# Altium schematic sheet P07_F28379D-PWR.SchDoc
size 301 x 239 mm
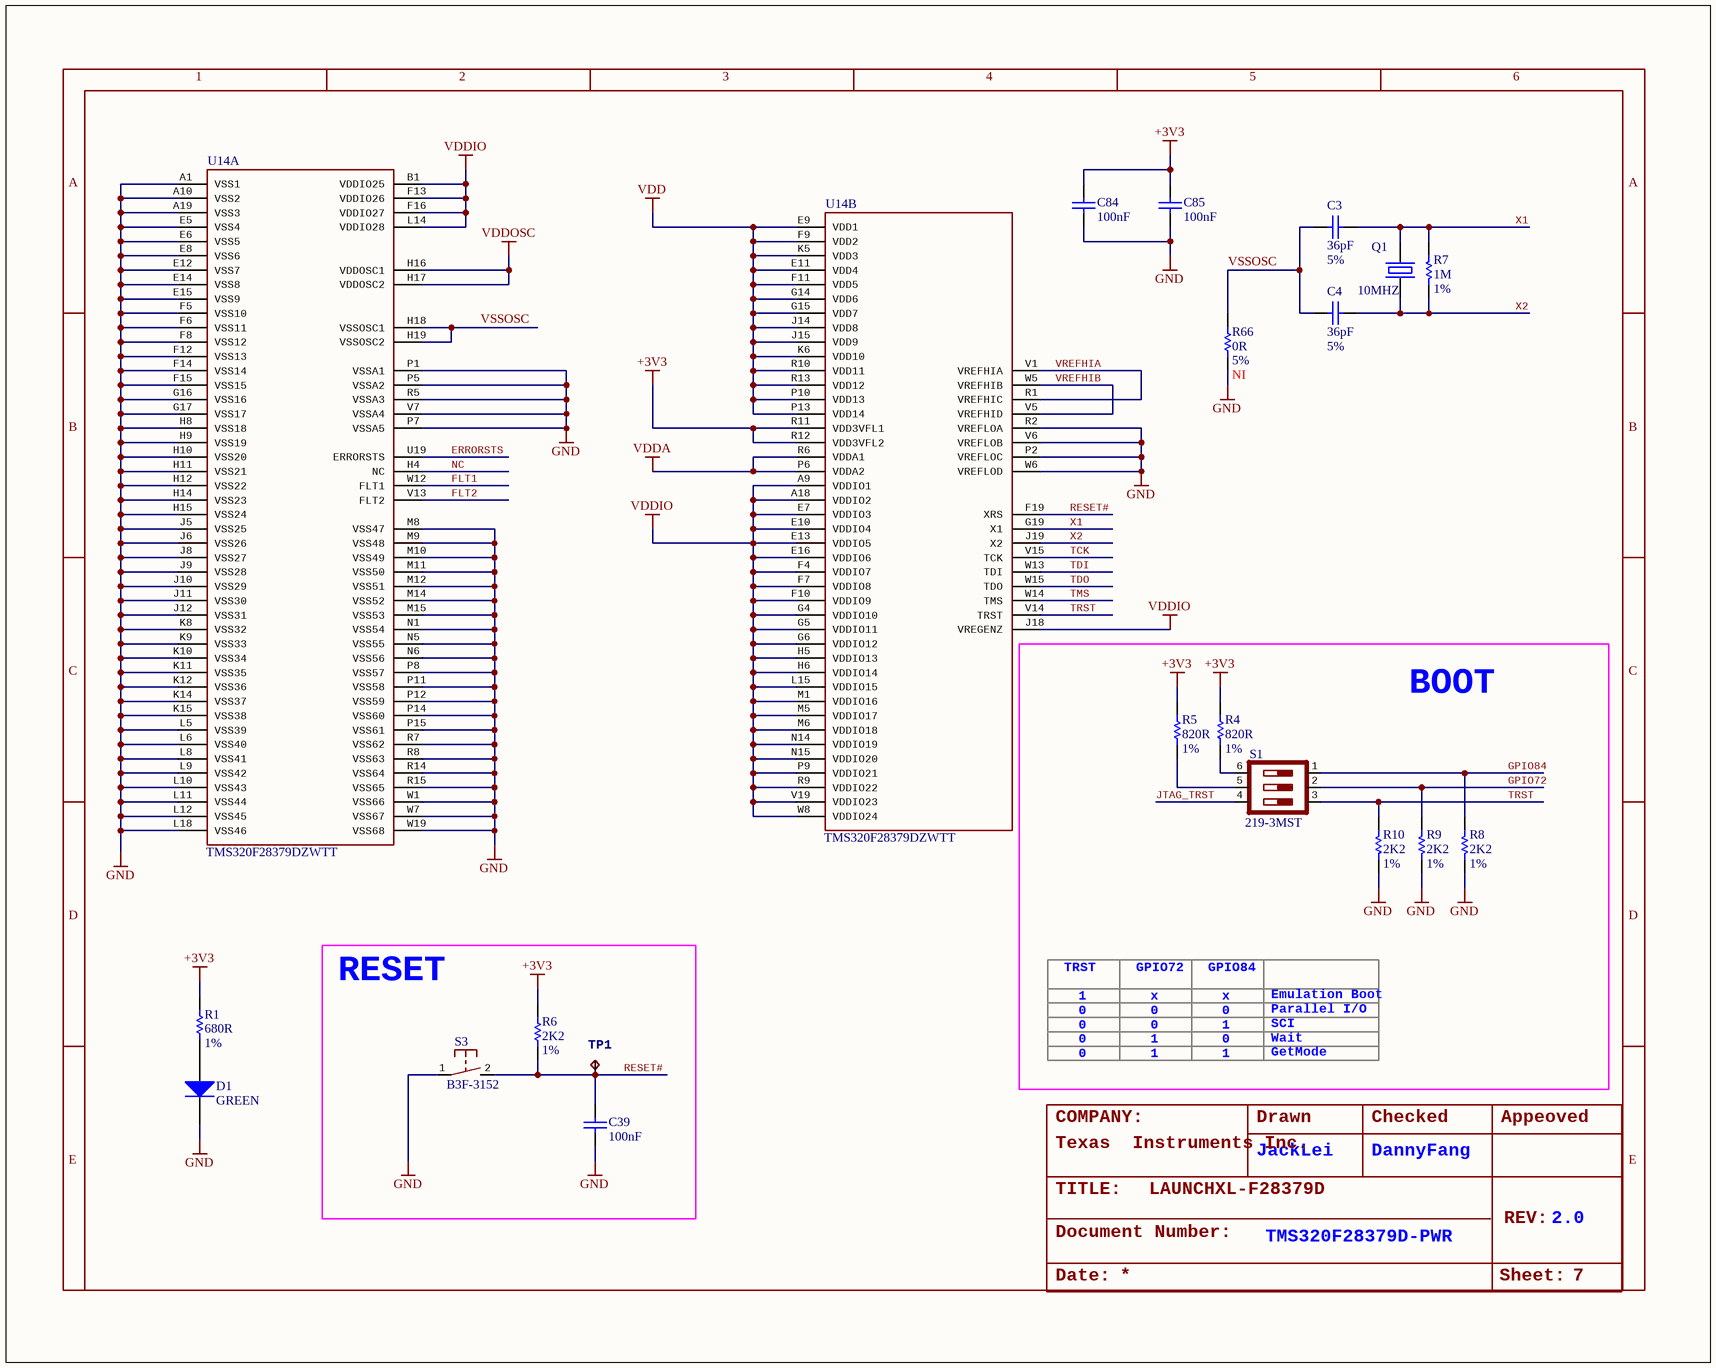
[diagram p0: P07_F28379D-PWR.SchDoc]

## Parts
C3  Rating: 5%  [C0402]  (hidden comment: 36pF)
C4  Rating: 5%  [C0402]  (hidden comment: 36pF)
C39  100nF  [C0402]
C84  100nF  [C0402]
C85  100nF  [C0402]
D1  value GREEN  [D0805]  (hidden comment: 150080VS75000)
Q1  value 10MHZ  [OSC488P1105X465X350-2N]  (hidden comment: ATS100B-E)
R1  Rating: 1%  [R0402]  (hidden comment: 680R)
R4  Rating: 1%  [R0402]  (hidden comment: 820R)
R5  Rating: 1%  [R0402]  (hidden comment: 820R)
R6  Rating: 1%  [R0402]  (hidden comment: 2K2)
R7  Rating: 1%  [R0402]  (hidden comment: 1M)
R8  Rating: 1%  [R0402]  (hidden comment: 2K2)
R9  Rating: 1%  [R0402]  (hidden comment: 2K2)
R10  Rating: 1%  [R0402]  (hidden comment: 2K2)
R66  Rating: 5%  ASSY: NI  [R0402]  (hidden comment: 0R)
S1  219-3MST  [SW254P990X385-6N]
S3  B3F-3152  [SW4P730X625]
TP1  TESTPAD_TPB1,27  [TESTPAD_B1,27]  (value not drawn)
U14  TMS320F28379DZWTT  [BGA337C80P19X19_1600X1600X140]  (parts A,B of 5)

## Blocks framed on the sheet
BOOT: R4 R5 R8-R10 S1
RESET: C39 R6 S3 TP1

## Nets
+3V3: C84.1 C85.1 R1.2 R4.2 R5.2 R6.2 U14.R11(VDD3VFL1) U14.R12(VDD3VFL2)
GND: C39.2 C84.2 C85.2 D1.1 R8.1 R9.1 R10.1 R66.2 S3.1(P) U14.A1(VSS1) U14.A10(VSS2) U14.A19(VSS3) U14.E5(VSS4) U14.E6(VSS5) U14.E8(VSS6) U14.E12(VSS7) U14.E14(VSS8) U14.E15(VSS9) U14.F5(VSS10) U14.F6(VSS11) U14.F8(VSS12) U14.F12(VSS13) U14.F14(VSS14) U14.F15(VSS15) U14.G16(VSS16) U14.G17(VSS17) U14.H8(VSS18) U14.H9(VSS19) U14.H10(VSS20) U14.H11(VSS21) U14.H12(VSS22) U14.H14(VSS23) U14.H15(VSS24) U14.J5(VSS25) U14.J6(VSS26) U14.J8(VSS27) U14.J9(VSS28) U14.J10(VSS29) U14.J11(VSS30) U14.J12(VSS31) U14.K8(VSS32) U14.K9(VSS33) U14.K10(VSS34) U14.K11(VSS35) U14.K12(VSS36) U14.K14(VSS37) U14.K15(VSS38) U14.L5(VSS39) U14.L6(VSS40) U14.L8(VSS41) U14.L9(VSS42) U14.L10(VSS43) U14.L11(VSS44) U14.L12(VSS45) U14.L18(VSS46) U14.M8(VSS47) U14.M9(VSS48) U14.M10(VSS49) U14.M11(VSS50) U14.M12(VSS51) U14.M14(VSS52) U14.M15(VSS53) U14.N1(VSS54) U14.N5(VSS55) U14.N6(VSS56) U14.P1(VSSA1) U14.P2(VREFLOC) U14.P5(VSSA2) U14.P7(VSSA5) U14.P8(VSS57) U14.P11(VSS58) U14.P12(VSS59) U14.P14(VSS60) U14.P15(VSS61) U14.R2(VREFLOA) U14.R5(VSSA3) U14.R7(VSS62) U14.R8(VSS63) U14.R14(VSS64) U14.R15(VSS65) U14.V6(VREFLOB) U14.V7(VSSA4) U14.W1(VSS66) U14.W6(VREFLOD) U14.W7(VSS67) U14.W19(VSS68)
VDD: U14.E9(VDD1) U14.E11(VDD4) U14.F9(VDD2) U14.F11(VDD5) U14.G14(VDD6) U14.G15(VDD7) U14.J14(VDD8) U14.J15(VDD9) U14.K5(VDD3) U14.K6(VDD10) U14.P10(VDD13) U14.P13(VDD14) U14.R10(VDD11) U14.R13(VDD12)
VDDA: U14.P6(VDDA2) U14.R6(VDDA1)
VDDIO: U14.A9(VDDIO1) U14.A18(VDDIO2) U14.B1(VDDIO25) U14.E7(VDDIO3) U14.E10(VDDIO4) U14.E13(VDDIO5) U14.E16(VDDIO6) U14.F4(VDDIO7) U14.F7(VDDIO8) U14.F10(VDDIO9) U14.F13(VDDIO26) U14.F16(VDDIO27) U14.G4(VDDIO10) U14.G5(VDDIO11) U14.G6(VDDIO12) U14.H5(VDDIO13) U14.H6(VDDIO14) U14.J18(VREGENZ) U14.L14(VDDIO28) U14.L15(VDDIO15) U14.M1(VDDIO16) U14.M5(VDDIO17) U14.M6(VDDIO18) U14.N14(VDDIO19) U14.N15(VDDIO20) U14.P9(VDDIO21) U14.R9(VDDIO22) U14.V19(VDDIO23) U14.W8(VDDIO24)
VDDOSC: U14.H16(VDDOSC1) U14.H17(VDDOSC2)
ERRORSTS: U14.U19(ERRORSTS)
FLT1: U14.W12(FLT1)
FLT2: U14.V13(FLT2)
GPIO72: R9.2 S1.2
GPIO84: R8.2 S1.1
JTAG_TRST: S1.4
NC: U14.H4(NC)
RESET#: C39.1 R6.1 S3.2(S) TP1.TP U14.F19(XRS)
TCK: U14.V15(TCK)
TDI: U14.W13(TDI)
TDO: U14.W15(TDO)
TMS: U14.W14(TMS)
TRST: R10.2 S1.3 U14.V14(TRST)
VREFHIA: U14.R1(VREFHIC) U14.V1(VREFHIA)
VREFHIB: U14.V5(VREFHID) U14.W5(VREFHIB)
VSSOSC: C3.2 C4.2 R66.1 U14.H18(VSSOSC1) U14.H19(VSSOSC2)
X1: C3.1 Q1.2 R7.2 U14.G19(X1)
X2: C4.1 Q1.1 R7.1 U14.J19(X2)
NetD1_2: D1.2 R1.1
NetR4_1: R4.1 S1.6
NetR5_1: R5.1 S1.5

## Notes on the sheet
- TRST
- 1
- 0
- GPIO72
- x
- GPIO84
- Emulation Boot
- Parallel I/O
- SCI
- Wait
- GetMode
- COMPANY:
- Texas
  Instruments Inc.
- JackLei
- Drawn
- Checked
- DannyFang
- Appeoved
- TITLE:
- Document Number:
- LAUNCHXL-F28379D
- TMS320F28379D-PWR
- REV:
- 2.0
- Date:
- Sheet:
- 7
- 2
- 3
- 4
- 5
- 6
- A
- B
- C
- D
- E

## Library data of the parts
C3 C4 = 1004001100255: CAP,36pF,+/-5%,C0G,50V,SMD0402; Manufacturer: MURATA; Manufacturer Part Number: GRM1555C1H360JA01D; Embest PN: 1004001100255; Value: 36pF; Part Type: Ceramic Capacitor
C39 C84 C85 = 1004001100187: CAP,100NF(0.1uf),+/-10%,X5R,10V,SMD0402; Manufacturer: MURATA; Manufacturer Part Number: GRM155R61A104KA01D; Rating: 10%; Embest PN: 1004001100187; Value: 100nF; Part Type: Ceramic Capacitor
D1 = 1006001100166: LED, Bright GREEN , 570nm,30mA,SMD,0805; Manufacturer: WURTH; Embest PN: 1006001100166; Part Type: LED; Manufacturer Part Number: 150080VS75000
Q1 = 1008002200125: Crystal 10.0000MHz 30ppm 18pF 60 Ohm -40°C - 85°C Through Hole HC49/US; Manufacturer: CTS; Embest PN: 1008002200125; Part Type: Crystal; Manufacturer Part Number: ATS100B-E
R1 = 1003001100490: RES,680R,+/-1%,1/16W,SMD0402; Manufacturer: YAGEO; Manufacturer Part Number: RC0402FR-07680RL; Embest PN: 1003001100490; Value: 680R; Part Type: Thick film Resistor
R4 R5 = 1003001100482: RES,820R,+/-1%,1/16W,SMD0402; Manufacturer: YAGEO; Manufacturer Part Number: RC0402FR-07820RL; Embest PN: 1003001100482; Value: 820R; Part Type: Thick film Resistor
R6 R8-R10 = 1003001100045: RES,2K2,+/-1%,1/16W,SMD0402; Manufacturer: YAGEO; Manufacturer Part Number: RC0402FR-072K2L; Embest PN: 1003001100045; Value: 2K2; Part Type: Thick film Resistor
R7 = 1003001100155: RES,1M,+/-1%,1/16W,SMD0402; Manufacturer: YAGEO; Manufacturer Part Number: RC0402FR-071ML; Embest PN: 1003001100155; Value: 1M; Part Type: Thick film Resistor
R66 = 1003001100001: RES,0R,+/-5%,1/16W,SMD0402; Manufacturer: YAGEO; Manufacturer Part Number: RC0402JR-070RL; Embest PN: 1003001100001; Value: 0R; Part Type: Thick film Resistor
S1 = 1010003100003: Switch, DIP Switches,3 Position,2.54MM Pitch,black housing,white plunger,SMD; Manufacturer: CTS; Embest PN: 1010003100003; Value: 219-3MST; Part Type: DIP Switch; Manufacturer Part Number: 219-3MST
S3 = 1010001200049: SWITCH TACTILE SPST-NO 0.05A 24V; Manufacturer: OMRON; Embest PN: 1010001200049; Value: B3F-3152; Part Type: Tactile Switch; Manufacturer Part Number: B3F-3152
TP1 = TESTPAD_TPB1,27: Test pad
U14 = 1002002100202C: IC, MCU 32BIT 1024KB,TMS320F28379DZWTT,BGA-337,SMD,customer supply; Manufacturer: TI; Embest PN: 1002002100202C; Value: TMS320F28379DZWTT; Part Type: MCU; Manufacturer Part Number: TMS320F28379DZWTT